# EAGLE design power led v4 (EAGLE 9.6.0)
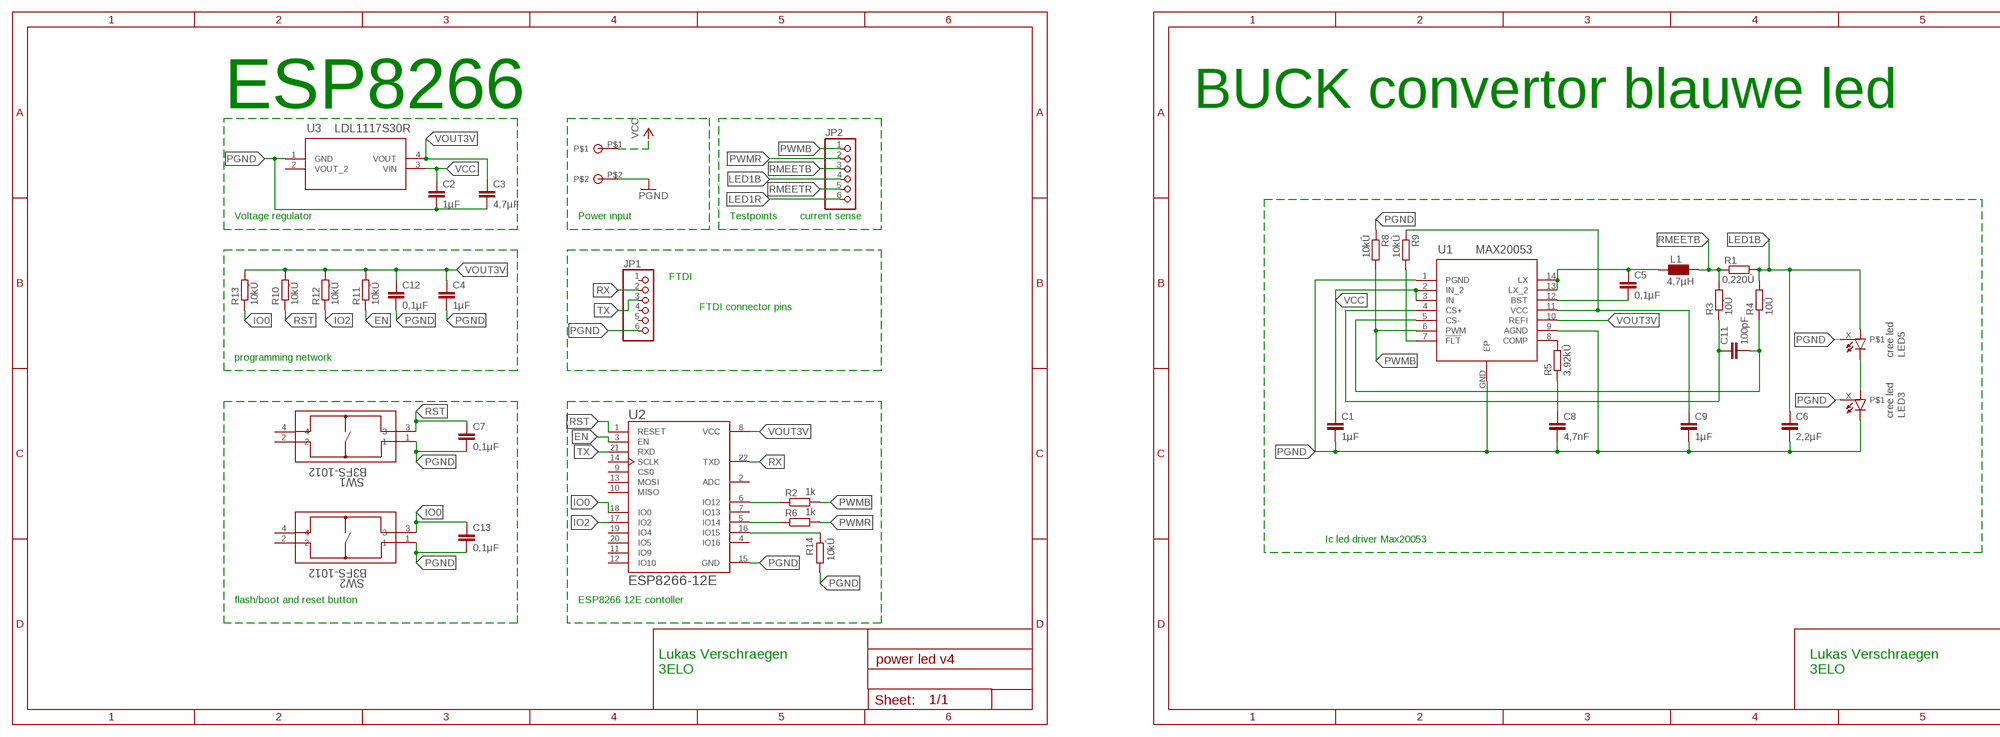
[diagram p0: schematic, sheet 1, part 1 of 2]
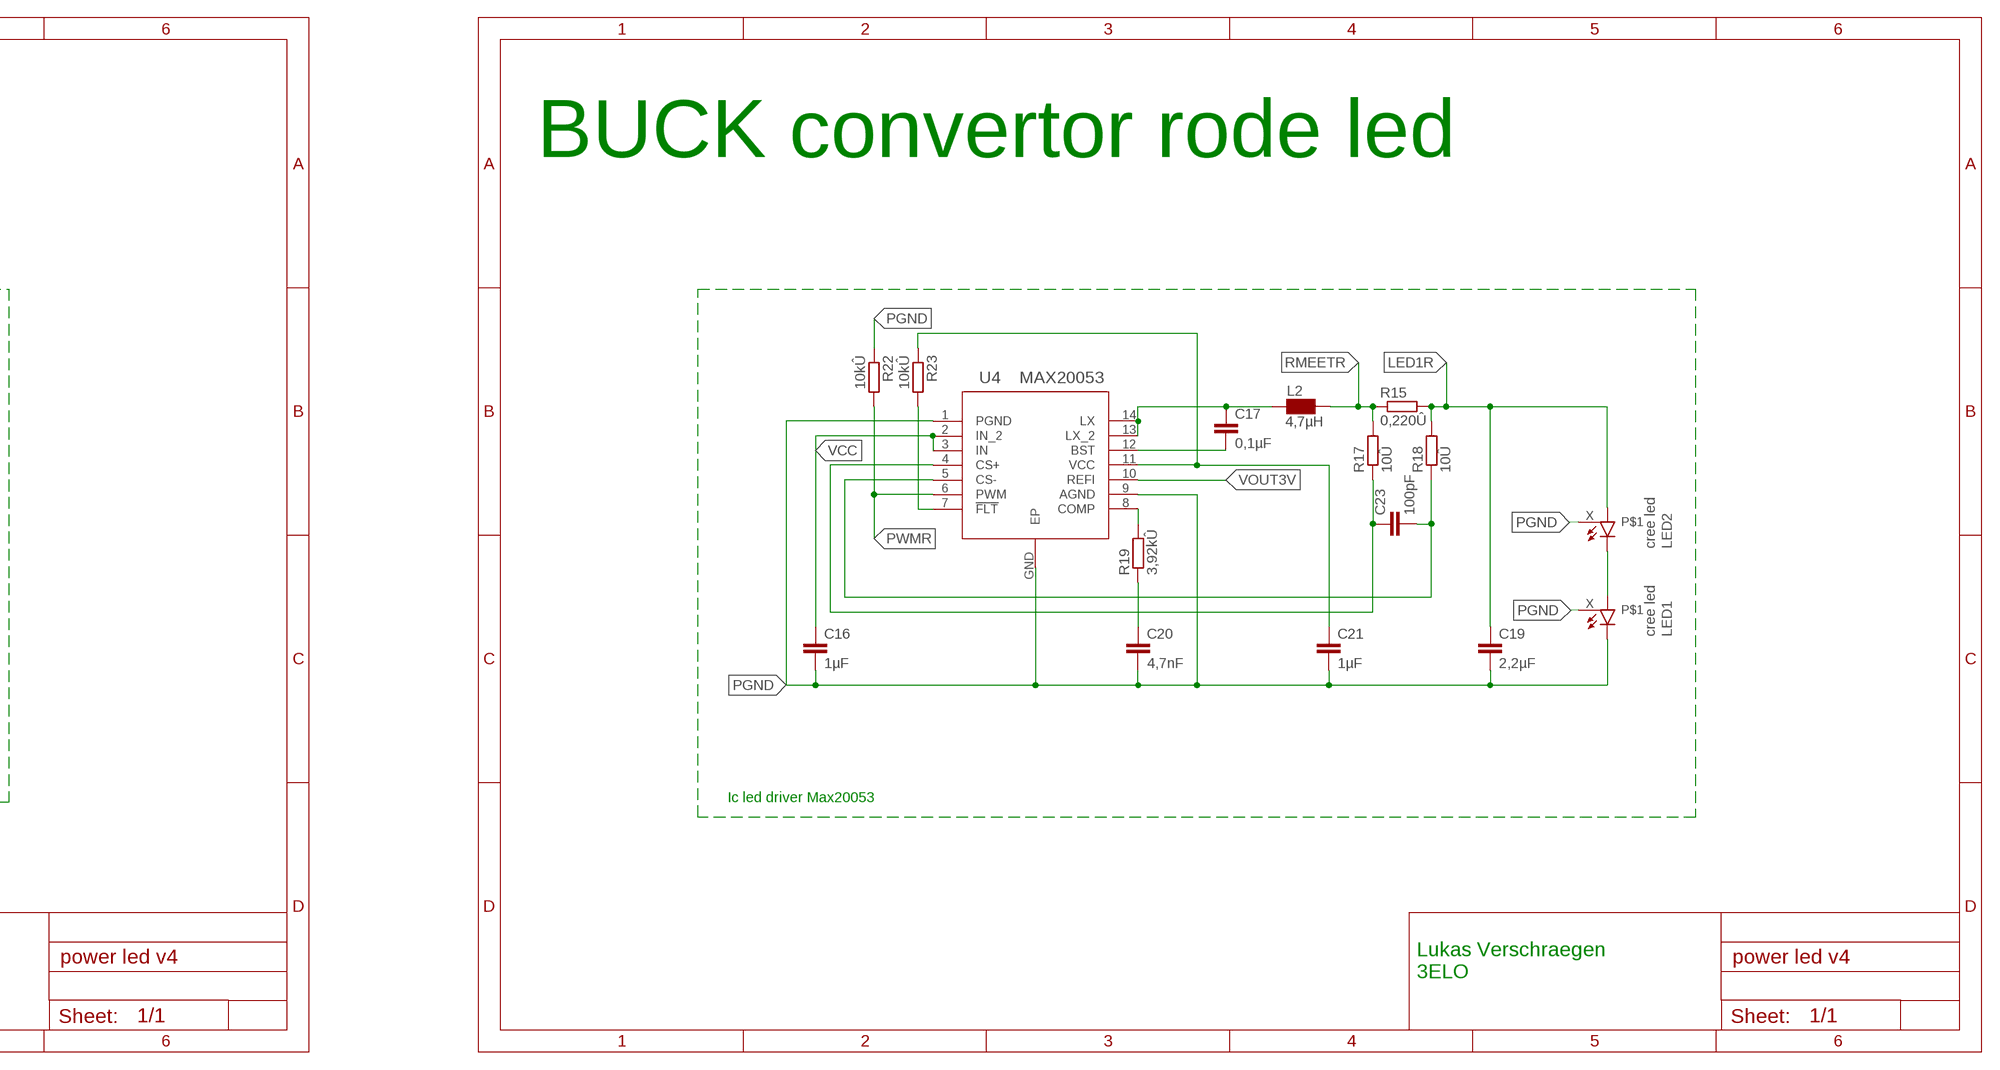
[diagram p1: schematic, sheet 1, part 2 of 2]

## Parts
C1  1µF  C-EUC1206  [C1206]
C2  1µF  C-EUC1206  [C1206]
C3  4,7µF  C-EUC1206  [C1206]
C4  1µF  C-EUC1206  [C1206]
C5  0,1µF  C-EUC1206  [C1206]
C6  2,2µF  C-EUC1206  [C1206]
C7  0,1µF  C-EUC1206  [C1206]
C8  4,7nF  C-EUC1206  [C1206]
C9  1µF  C-EUC1206  [C1206]
C11  100pF  C-EUC1206  [C1206]
C12  0,1µF  C-EUC1206  [C1206]
C13  0,1µF  C-EUC1206  [C1206]
C16  1µF  C-EUC1206  [C1206]
C17  0,1µF  C-EUC1206  [C1206]
C19  2,2µF  C-EUC1206  [C1206]
C20  4,7nF  C-EUC1206  [C1206]
C21  1µF  C-EUC1206  [C1206]
C23  100pF  C-EUC1206  [C1206]
JP1  PINHD-1X6  [1X06]
JP2  PINHD-1X6  [1X06]
L1  4,7µH  7447789004IND_7447789004_WRE-M  [IND_7447789004_WRE-M]
L2  4,7µH  7447789004IND_7447789004_WRE-M  [IND_7447789004_WRE-M]
LED1  cree led  XPEWHT-01-0000-00BC2  [CREE_XLAMP]
LED2  cree led  XPEWHT-01-0000-00BC2  [CREE_XLAMP]
LED3  cree led  XPEWHT-01-0000-00BC2  [CREE_XLAMP]
LED5  cree led  XPEWHT-01-0000-00BC2  [CREE_XLAMP]
R1  0,220Û  R-EU_R1206  [R1206]
R2  1k  R-EU_R1206  [R1206]
R3  10Û  R-EU_R1206  [R1206]
R4  10Û  R-EU_R1206  [R1206]
R5  3,92kÛ  R-EU_R1206  [R1206]
R6  1k  R-EU_R1206  [R1206]
R8  10kÛ  R-EU_R1206  [R1206]
R9  10kÛ  R-EU_R1206  [R1206]
R10  10kÛ  R-EU_R1206  [R1206]
R11  10kÛ  R-EU_R1206  [R1206]
R12  10kÛ  R-EU_R1206  [R1206]
R13  10kÛ  R-EU_R1206  [R1206]
R14  10kÛ  R-EU_R1206  [R1206]
R15  0,220Û  R-EU_R1206  [R1206]
R17  10Û  R-EU_R1206  [R1206]
R18  10Û  R-EU_R1206  [R1206]
R19  3,92kÛ  R-EU_R1206  [R1206]
R22  10kÛ  R-EU_R1206  [R1206]
R23  10kÛ  R-EU_R1206  [R1206]
SW1  B3FS-1012  [SW_B3FS-1010_OMR]
SW2  B3FS-1012  [SW_B3FS-1010_OMR]
U1  MAX20053  MAX20053AUD/V+21-0108-E_14L_MXM-M  [21-0108-E_14L_MXM-M]
U2  ESP8266-12E  ESP8266-12E/ESP-12E  [XCVR_ESP8266-12E/ESP-12E]
U3  LDL1117S30R  [SOT223_STM]
U4  MAX20053  MAX20053AUD/V+21-0108-E_14L_MXM-M  [21-0108-E_14L_MXM-M]
X1  TERMINA5MM  [TERMINAL5MM]

## Nets
BSTB: C5.2 U1.12(BST)
BSTR: C17.2 U4.12(BST)
COMPB: R5.2 U1.8(COMP)
COMPR: R19.2 U4.8(COMP)
CS+B: C11.1 R3.1 U1.4(CS+)
CS+R: C23.1 R17.1 U4.4(CS+)
CS-B: C11.2 R4.1 U1.5(CS-)
CS-R: C23.2 R18.1 U4.5(CS-)
EN: R11.1 U2.3(EN)
FLTB: R9.2 U1.7(!FLT)
FLTR: R23.2 U4.7(!FLT)
IO0: C13.1 R13.1 SW2.3 U2.18(IO0)
IO2: R12.1 U2.17(IO2)
IO15: R14.1 U2.16(IO15)
LED1B: C6.1 JP2.4 LED5.A LED5.A@1(A) R1.2 R4.2
LED1R: C19.1 JP2.6 LED2.A LED2.A@1(A) R15.2 R18.2
LED2B: LED3.A LED3.A@1(A) LED5.C LED5.C@1(C)
LED2R1: LED1.A LED1.A@1(A) LED2.C LED2.C@1(C)
LXB: C5.1 L1.2 U1.13(LX_2) U1.14(LX)
LXR: C17.1 L2.2 U4.13(LX_2) U4.14(LX)
N$2: C20.1 R19.1
N$5: C8.1 R5.1
N$24: R2.1 U2.6(IO12)
N$25: R6.1 U2.5(IO14)
PGND: C1.2 C2.2 C3.2 C4.2 C6.2 C7.2 C8.2 C9.2 C12.2 C13.2 C16.2 C19.2 C20.2 C21.2 JP1.6 LED1.C LED1.C@1(C) LED1.X LED2.X LED3.C LED3.C@1(C) LED3.X LED5.X R8.1 R14.2 R22.1 SW1.1 SW2.1 U1.1(PGND) U1.9(AGND) U1.GND(EP) U2.15(GND) U3.1(GND) U4.1(PGND) U4.9(AGND) U4.GND(EP) X1.P$2
PWMB: JP2.1 R2.2 R8.2 U1.6(PWM)
PWMR: JP2.2 R6.2 R22.2 U4.6(PWM)
RMEETB: JP2.3 L1.1 R1.1 R3.2
RMEETR: JP2.5 L2.1 R15.1 R17.2
RST: C7.1 R10.1 SW1.3 U2.1(RESET)
RX: JP1.2 U2.22(TXD)
TX: JP1.3 U2.21(RXD)
VCC: C1.1 C2.1 C16.1 U1.2(IN_2) U1.3(IN) U3.3(VIN) U4.2(IN_2) U4.3(IN) X1.P$1
VCCB: C9.1 R9.1 U1.11(VCC)
VCCR: C21.1 R23.1 U4.11(VCC)
VOUT3V: C3.1 C4.1 C12.1 R10.2 R11.2 R12.2 R13.2 U1.10(REFI) U2.8(VCC) U3.4(VOUT) U4.10(REFI)
Unconnected: JP1.1 JP1.4 JP1.5 SW1.2 SW1.4 SW2.2 SW2.4 U2.2(ADC) U2.4(IO16) U2.7(IO13) U2.9(CS0) U2.10(MISO) U2.11(IO9) U2.12(IO10) U2.13(MOSI) U2.14(SCLK) U2.19(IO4) U2.20(IO5) U3.2(VOUT_2)

## Notes on the sheet
- ESP8266 | BUCK convertor blauwe led | BUCK convertor rode led
- Voltage regulator | Power input | Testpoints | current sense
- FTDI
- FTDI connector pins
- programming network
- Ic led driver Max20053
- Ic led driver Max20053
- flash/boot and reset button | ESP8266 12E contoller
- Lukas Verschraegen
  3ELO
- Lukas Verschraegen
  3ELO
- Lukas Verschraegen
  3ELO

## Library data of the parts
C1-C9 C11-C13 C16 C17 C19-C21 C23 = rcl:C-EU: CAPACITOR, European symbol; SPICEPREFIX: C
JP1 JP2 = pinhead:PINHD-1X6: PIN HEADER
L1 L2 = 7447789004:7447789004; COPYRIGHT: Copyright (C) 2022 Ultra Librarian. All rights reserved.; MANUFACTURER_PART_NUMBER: 7447789004; MFR_NAME: Wurth Electronics
LED1-LED3 LED5 = led:XPEWHT-: Cree® XLamp® XP-E LEDs Source: www.cree.com/xlamp .. XLampXP-E.pdf
R1-R6 R8-R15 R17-R19 R22 R23 = rcl:R-EU_: RESISTOR, European symbol; SPICEPREFIX: R
SW1 SW2 = omron B3FS-1012:B3FS-1012; BUILT_BY: EMA_Justin; COPYRIGHT: Copyright (C) 2018 Accelerated Designs. All rights reserved; DATASHEET: https://omronfs.omron.com/en_US/ecb/products/pdf/en-b3fs.pdf; MANUFACTURER_PART_NUMBER: B3FS-1012; SOURCELIBRARY: Omron_2020-06-30; VENDOR: Omron
U1 U4 = max20053:MAX20053AUD/V+; COPYRIGHT: Copyright (C) 2022 Ultra Librarian. All rights reserved.; MANUFACTURER_PART_NUMBER: MAX20053AUD/V+; MFR_NAME: Maxim Integrated Products
U2 = ESP8266-12E_ESP-12E:ESP8266-12E/ESP-12E: ESP-12E WiFi Module Check availability <https://pricing.snapeda.com/parts/ESP8266-12E/ESP-12E/AI-Thinker/view-part?ref=eda>; AVAILABILITY: Not in stock; DESCRIPTION: This WiFi module has a 32-bit MCU micro and clock speeds supporting 80 MHz or 160 MHz. Supports the RTOS and integrated Wi-Fi MAC/BB/RF/PA/LNA, and has an on-board antenna.; MF: AI-Thinker; MP: ESP8266-12E/ESP-12E; PACKAGE: None; PRICE: None
U3 = ldl1117s30r:LDL1117S30R; COPYRIGHT: Copyright (C) 2022 Ultra Librarian. All rights reserved.; MANUFACTURER_PART_NUMBER: LDL1117S30R; MFR_NAME: STMicroelectronics
X1 = Terminal 5mm:TERMINA5MM

## Board
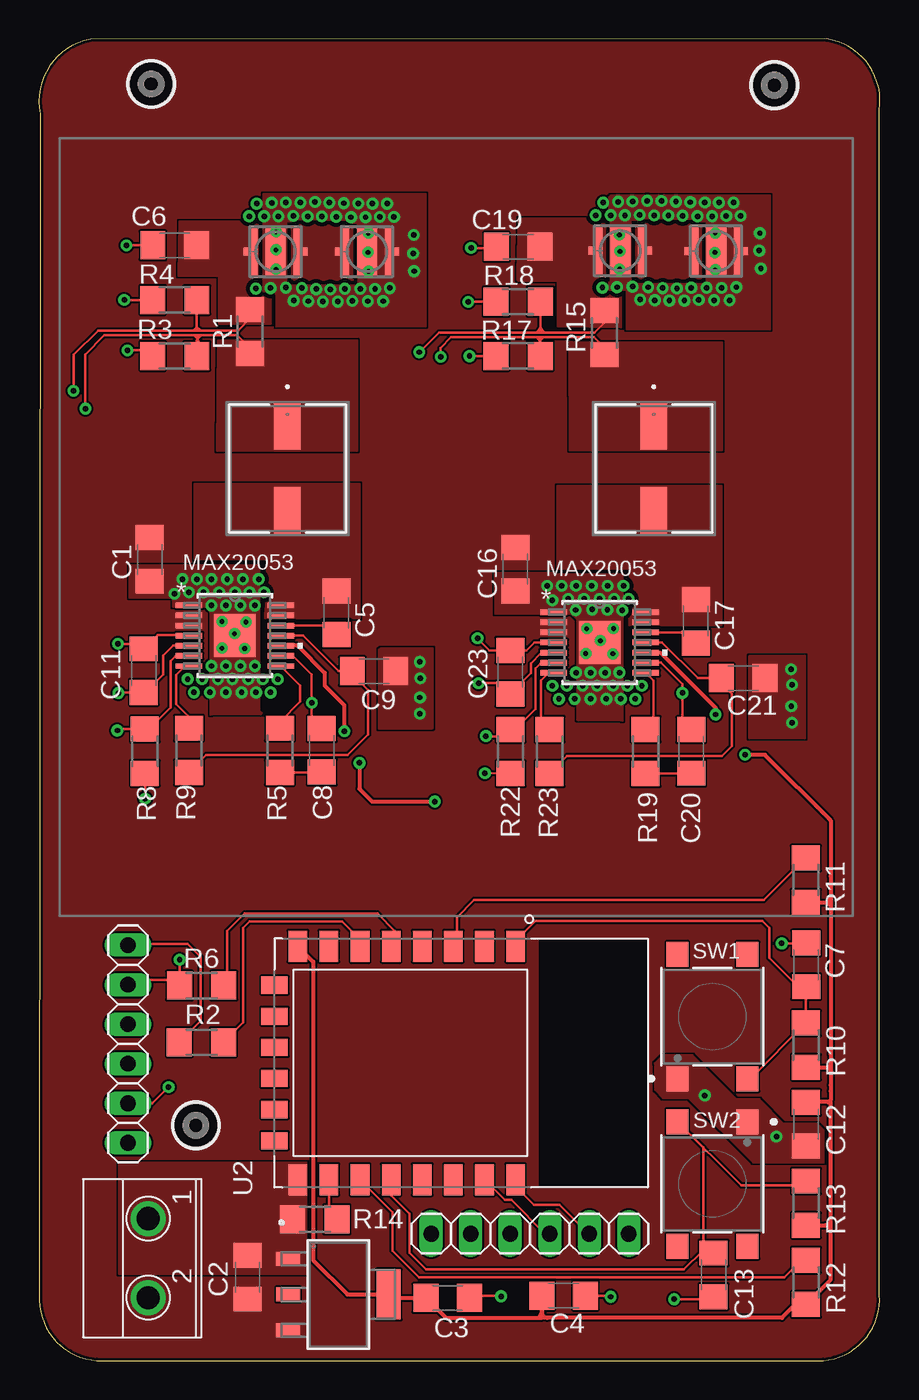
[diagram p2: board, top side]
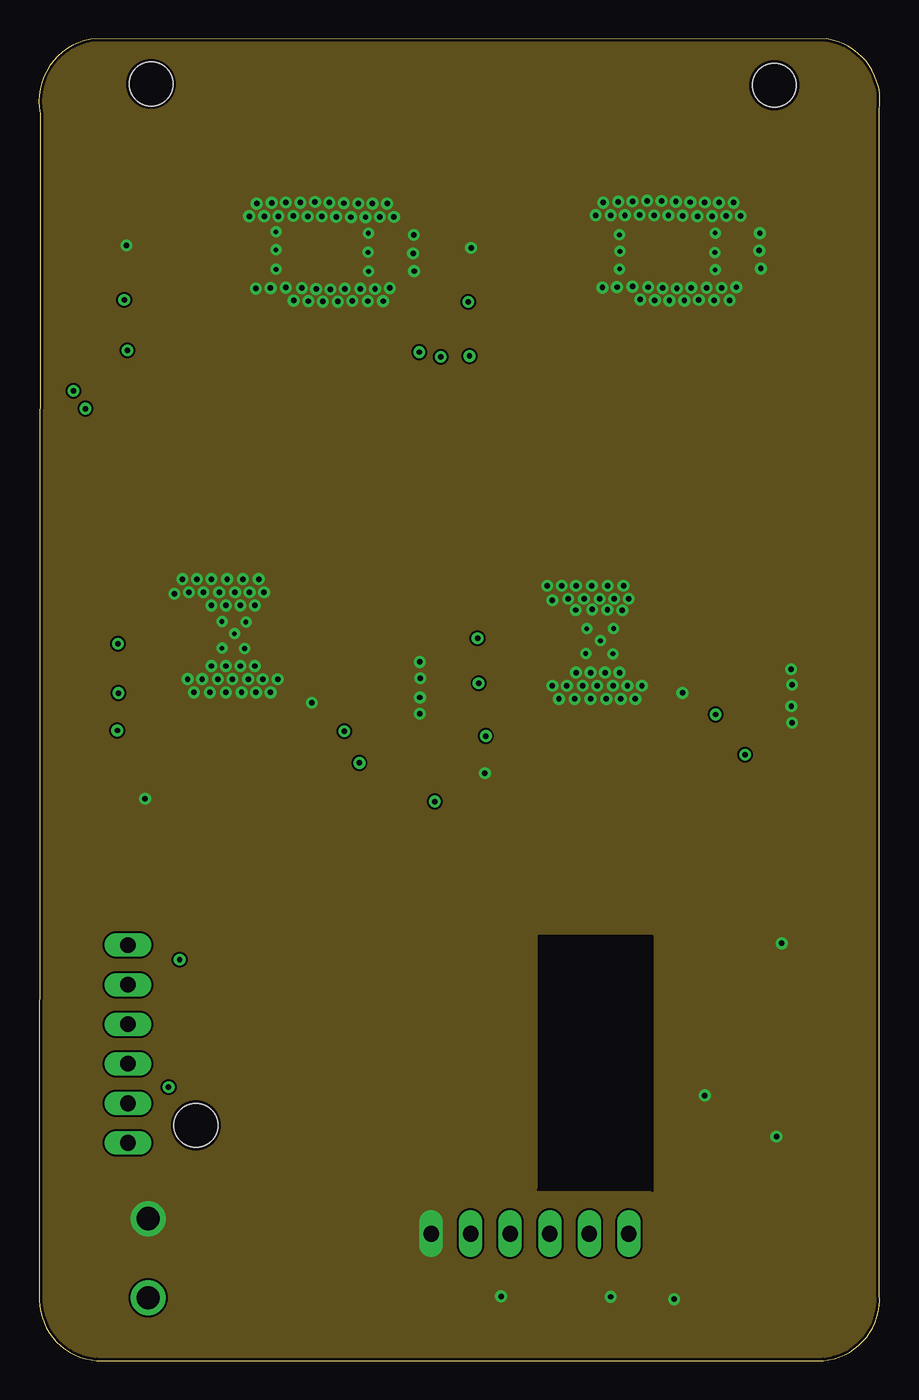
[diagram p3: board, inner layer AGND]
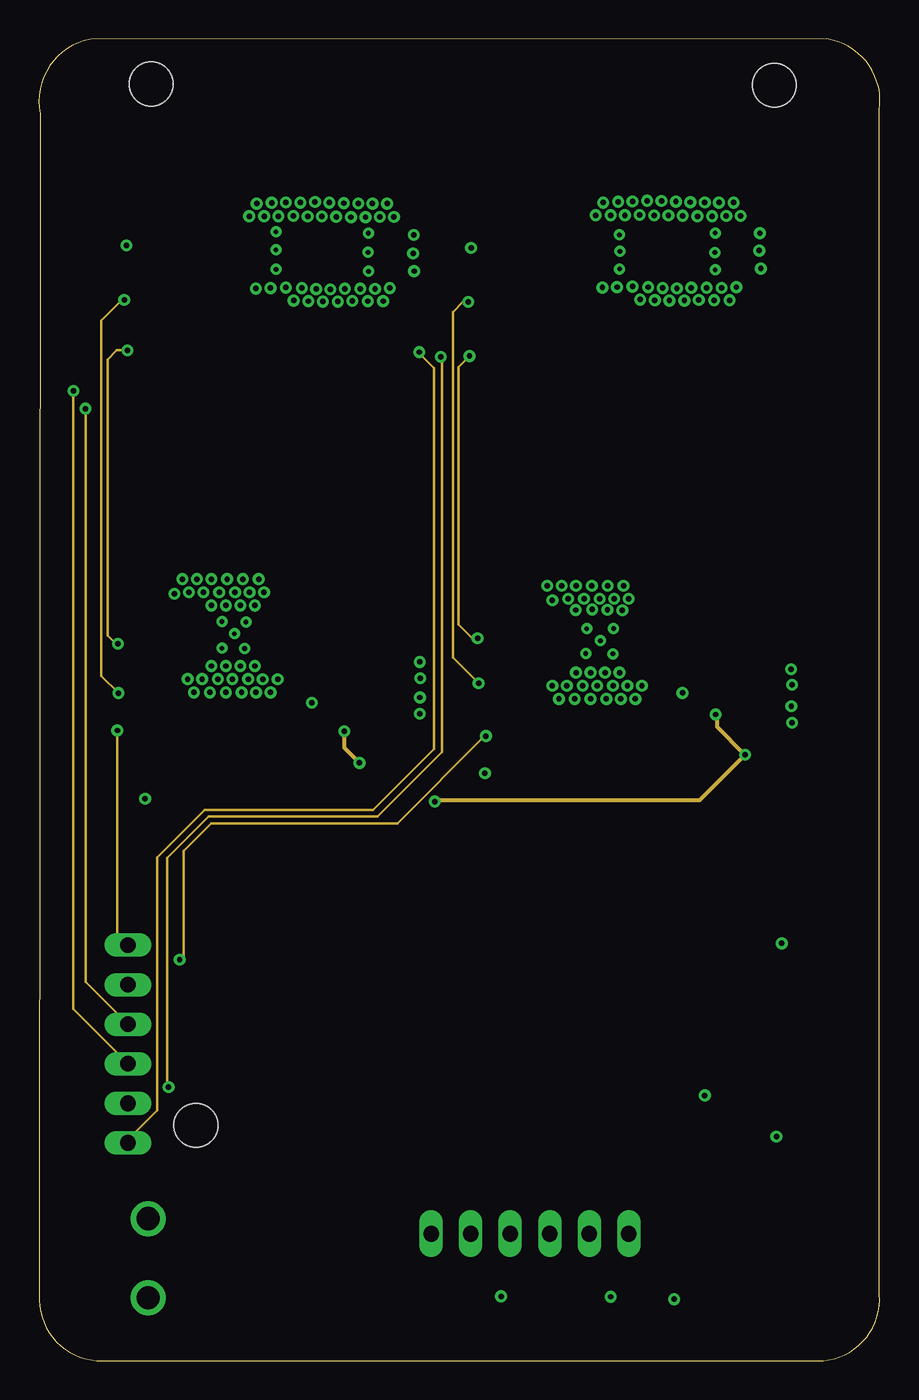
[diagram p4: board, inner layer SIGNAL]
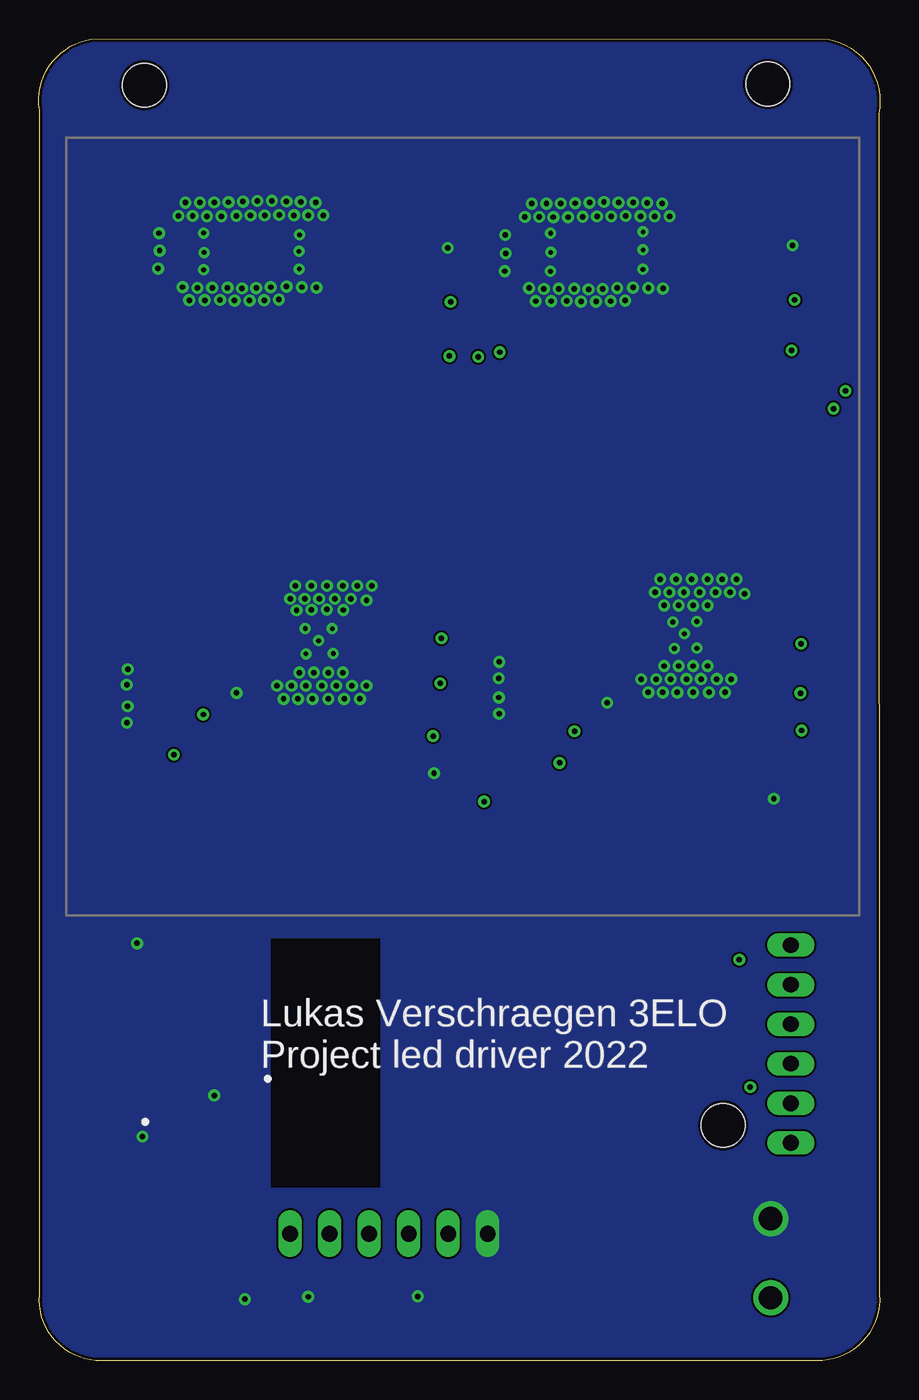
[diagram p5: board, bottom side, seen from below]

Size 54.07 x 84.95 mm. Coordinates in mm from the lower left corner, seen from the top.
Outline: 0.07,80.15 0.03,4.23 arc90 3.72,0 50.41,0 arc90 54.03,4.24 54.03,80.38 arc90 50.65,84.96 3.32,84.94 arc90 0.07,80.15
Copper layers (1+2*15+16): SIGNAL+POWER 0.035mm / dielectric 0.2mm / AGND 0.0175mm / dielectric 1.065mm / SIGNAL 0.0175mm / dielectric 0.2mm / PGND 0.035mm
Design rules "jlcpcb-4layers *": minimum track width 3.5mil, minimum drill 0.2mm, track to track 5mil, track to pad 0.2mm, pad to pad 5mil, via to via 0.5mm, smd to smd 5mil, copper to edge 0.2mm, drill to drill 6mil, minimum pad ring 10mil, minimum via ring 8mil, stop-mask expansion 0.05mm, vias tented up to drill 16mil, thermal gap 10mil

### Footprints (pad centres in the part's own frame; a part is rotated, then mirrored left to right if it is on the bottom)
C1206 = smd 1.6 x 1.8: 1 -1.4,0; 2 1.4,0
1X06 = drill 1.016 long: 1 -6.35,0; 2 -3.81,0; 3 -1.27,0; 4 1.27,0; 5 3.81,0; 6 6.35,0
IND_7447789004_WRE-M = smd 3.048 x 1.702: 1 -2.731,0; 2 2.731,0
CREE_XLAMP = smd 0.5 x 3.3: A -1.4,0; C 1.4,0 | smd 0.45 x 0.5: A@1 -1.825,0; C@1 1.825,0 | smd 1.3 x 3.3: X 0,0
R1206 = smd 1.6 x 1.803: 1 -1.422,0; 2 1.422,0
SW_B3FS-1010_OMR = smd 1.6 x 1.4: 1 -4,2.25; 2 4,2.25; 3 -4,-2.25; 4 4,-2.25
21-0108-E_14L_MXM-M = smd 1.716 x 0.351: 1 -2.951,1.95; 2 -2.951,1.3; 3 -2.951,0.65; 4 -2.951,0; 5 -2.951,-0.65; 6 -2.951,-1.3; 7 -2.951,-1.95; 8 2.951,-1.95; 9 2.951,-1.3; 10 2.951,-0.65; 11 2.951,0; 12 2.951,0.65; 13 2.951,1.3; 14 2.951,1.95 | smd 2.665 x 2.77: GND 0,0
XCVR_ESP8266-12E/ESP-12E = smd 2 x 1.2: 1 -7.5,7; 2 -7.5,5; 3 -7.5,3; 4 -7.5,1; 5 -7.5,-1; 6 -7.5,-3; 7 -7.5,-5; 8 -7.5,-7; 15 7.5,-7; 16 7.5,-5; 17 7.5,-3; 18 7.5,-1; 19 7.5,1; 20 7.5,3; 21 7.5,5; 22 7.5,7 | smd 1.1 x 1.7: 9 -5,-8.5; 10 -3,-8.5; 11 -1,-8.5; 12 1,-8.5; 13 3,-8.5; 14 5,-8.5
SOT223_STM = smd 0.901 x 1.549: 1 -2.3,-3.226; 2 0,-3.226; 3 2.3,-3.226 | smd 3.2 x 1.549: 4 0,3.226
2,8 = hole 2.8: 0,0
TERMINAL5MM = drill 1.5: P$1 4.191,2.54; P$2 4.191,7.62

### Placement (x,y rotation side)
C1  7.13,51.49 270 top
C2  13.42,5.36 90 top
C3  26.28,4.03 0 top
C4  33.74,4.18 0 top
C5  19.13,48.07 270 top
C6  8.73,71.68 180 top
C7  49.33,25.44 90 top
C8  18.18,39.22 90 top
C9  21.55,44.31 0 top
C11  6.75,44.35 270 top
C12  49.32,15.19 270 top
C13  43.37,5.51 270 top
C16  30.63,50.87 270 top
C17  42.22,47.53 270 top
C19  30.82,71.6 180 top
C20  41.94,39.15 90 top
C21  45.28,43.87 0 top
C23  30.31,44.25 270 top
JP1  31.57,8.16 180 top
JP2  5.73,20.35 270 top
L1  15.98,57.34 270 top
L2  39.53,57.34 270 top
LED1  43.54,71.31 0 top
LED2  37.37,71.34 0 top
LED3  21.1,71.27 0 top
LED5  15.22,71.27 0 top
R1  13.58,66.13 90 top
R2  10.45,20.46 180 top
R3  8.73,64.57 0 top
R4  8.73,68.17 0 top
R5  15.5,39.22 90 top
R6  10.46,24.1 180 top
R8  6.81,39.17 90 top
R9  9.65,39.22 90 top
R10  49.32,20.27 270 top
R11  49.3,30.88 270 top
R12  49.32,5.04 270 top
R13  49.32,10.12 270 top
R14  17.74,9.08 180 top
R15  36.35,66.07 90 top
R17  30.82,64.58 0 top
R18  30.82,68.07 0 top
R19  39,39.15 90 top
R22  30.32,39.15 90 top
R23  32.83,39.15 90 top
SW1  43.3,22.11 90 top
SW2  43.3,11.36 270 top
U1  12.6,46.6 0 top
U2  23.64,19.13 270 top
U3  19.25,4.25 270 top
U4  36.05,46.16 0 top
U$1  [2,8]  10.09,15.11 0 top
U$2  [2,8]  47.29,81.98 0 top
U$3  [2,8]  7.21,82.05 0 top
X1  2.83,1.5 0 top

### Tracks (layer width: path | path; a pad name or v marks a point on that pad's centre or on a via)
BSTB
  SIGNAL+POWER 0.152: U1.12 18.55,47.25 C5.2
BSTR
  SIGNAL+POWER 0.152: U4.12 41.54,46.81 C17.2
COMPB
  SIGNAL+POWER 0.152: R5.2 15.5,41.06 16.8,42.36 16.8,43.4 U1.8
COMPR
  SIGNAL+POWER 0.152: R19.2 39.5,41.08 39.5,43.71 U4.8
CS+B  (via drill 0.35)
  SIGNAL+POWER 0.152: U1.4 9.61,46.64 7.64,46.64 C11.1 6.43,46.07 v5.07,46.07 | R3.1 6.94,64.94 v5.69,64.94
  SIGNAL 0.152: v5.69,64.94 5.01,64.94 4.42,64.34 4.42,46.62 4.97,46.07 v5.07,46.07
CS+R  (via drill 0.35)
  SIGNAL+POWER 0.152: U4.4 31.86,46.16 31.35,45.65 C23.1 28.97,45.65 v28.2,46.42 | R17.1 27.69,64.58 v27.68,64.57
  SIGNAL 0.152: v27.68,64.57 26.98,63.87 26.98,47.3 27.86,46.42 v28.2,46.42
CS-B  (via drill 0.35)
  SIGNAL+POWER 0.152: U1.5 8.62,45.95 7.98,45.31 7.98,44.11 6.83,42.95 C11.2 5.16,42.95 v5.12,42.91 | v5.49,68.18 5.5,68.17 R4.1
  SIGNAL 0.152: v5.49,68.18 5.34,68.18 4.01,66.85 4.01,44.01 v5.12,42.91
CS-R  (via drill 0.35)
  SIGNAL+POWER 0.152: R18.1 27.62,68.07 v27.61,68.05 | v28.27,43.54 29.61,43.54 C23.2 31.64,44.18 31.64,44.82 32.32,45.5 33.09,45.5 U4.5
  SIGNAL 0.152: v27.61,68.05 27.28,68.05 26.63,67.41 26.63,45.18 v28.27,43.54
EN
  SIGNAL+POWER 0.152: R11.1 46.6,29.6 27.98,29.6 26.87,28.49 26.87,26.86 U2.3
FLTB
  SIGNAL+POWER 0.152: U1.7 9.4,44.65 8.82,44.07 8.82,42.2 9.65,41.36 R9.2
FLTR
  SIGNAL+POWER 0.152: U4.7 33.08,44.19 32.76,44.19 32.29,43.72 32.29,41.12 R23.2
IO0
  SIGNAL+POWER 0.152: R13.1 49.03,11.26 45.15,11.26 SW2.3 42.7,13.71 42.7,7.57 C13.1 42.89,6.91 42.7,7.09 41.46,5.85 24.89,5.85 23.81,6.93 23.81,9.45 22.64,10.62 U2.18
IO2
  SIGNAL+POWER 0.152: R12.1 49.32,6.76 47.93,5.37 24.89,5.37 24.43,5.37 22.74,7.05 22.74,9.53 U2.17
IO15
  SIGNAL+POWER 0.152: U2.16 18.64,9.62 19.16,9.11 R14.1
LED1B  (via drill 0.35)
  SIGNAL+POWER 0.152: 10.38,66.21 12.8,66.21 13.58,66.99 R1.2 | 10.38,66.21 10.16,66.21 | 10.16,66.21 10.16,66.4 10.16,66.43 | 10.16,66.43 10.16,66.44 9.93,66.21 | R4.2 10.16,66.43 | 9.93,66.21 3.81,66.21 2.25,64.65 2.25,62.36 v2.22,62.33 | 9.93,66.21 10.16,66.21 | 10.16,66.43 10.38,66.21
  SIGNAL 0.152: v2.22,62.33 2.22,22.59 JP2.4
  pour SIGNAL+POWER (isolate 0.254, no thermals): 9.04,73.2 9,69.75 11.59,69.75 11.6,66.65 12.36,66.65 12.38,66.64 14.9,66.66 14.9,68.47 14.05,68.47 14.05,73.2
LED1R  (via drill 0.35)
  SIGNAL+POWER 0.152: R15.2 36.35,66.71 35.71,66.07 32.42,66.07 | 32.42,66.07 32.34,66.07 32.25,66.07 | 32.24,66.4 R18.2 | 32.42,66.07 32.3,66.18 | 32.42,66.07 32.46,66.07 32.24,66.38 | 32.25,66.07 32.02,66.07 | 32.02,66.07 25.72,66.07 24.48,64.82 v24.45,64.82 | 32.24,66.38 32.24,66.08 32.25,66.07 | 32.24,66.38 32.24,66.4 | 32.24,66.4 32.02,66.07
  SIGNAL 0.152: JP2.6 5.73,14.21 7.59,16.07 7.59,32.34 10.65,35.4 21.48,35.4 25.39,39.3 25.39,63.78 24.45,64.72 v24.45,64.82
  pour SIGNAL+POWER (isolate 0.254, no thermals): 30.86,73.42 30.78,69.95 30.78,69.48 30.83,69.43 30.83,69.42 33.38,69.42 33.38,66.5 37.43,66.42 37.43,68.64 36.41,68.64 36.41,73.42
LED2B
  pour SIGNAL+POWER (isolate 0.254, no thermals): 16.28,73.09 16.28,69.47 20.25,69.47 20.25,73.09
LED2R1
  pour SIGNAL+POWER (isolate 0.254, no thermals): 38.43,73.14 38.43,69.56 42.54,69.56 42.54,73.14
LXB
  pour SIGNAL+POWER (isolate 0.254, no thermals): 10.03,56.33 20.61,56.33 20.61,47.72 18,47.71 18,47.72 14.55,47.72 14.69,51.51 10.03,51.51
LXR
  pour SIGNAL+POWER (isolate 0.254, no thermals): 33.35,56.2 33.35,50.92 37.98,50.91 37.98,47.27 43.89,47.27 43.89,56.2
N$1
  cutout AGND: 32.15,27.29 32.15,11.04 32.09,10.97 39.38,10.97 39.44,10.91 39.44,27.25 39.4,27.29 32.16,27.29 32.15,27.28
N$2
  SIGNAL+POWER 0.152: C20.1 41.91,37.73 R19.1
N$5
  SIGNAL+POWER 0.152: C8.1 18.15,37.8 R5.1
N$24
  SIGNAL+POWER 0.152: U2.6 20.86,26.85 19.48,28.23 13.55,28.23 13.14,27.82 13.14,21.73 R2.1
N$25
  SIGNAL+POWER 0.152: U2.5 22.87,26.86 22.87,27.62 21.77,28.73 13.21,28.73 12.11,27.62 12.11,24.33 R6.1
PGND  (via drill 0.3, 0.35)
  SIGNAL+POWER 0.152: C6.2 v5.63,71.68 | 16.66,9.87 16.64,9.88 | C19.2 29.33,71.52 v27.78,71.52 | C3.2 27.82,4.16 29.67,4.16 v29.71,4.13 | v36.76,4.1 36.68,4.18 C4.2 | C7.2 49.32,26.82 v47.76,26.82 | C13.2 43.2,3.95 v40.84,3.95 | C8.2 17.54,41.25 v17.54,42.28 17.54,44.09 16.34,45.3 U1.9 | U4.9 40,44.86 41.37,43.49 v41.37,42.92 41.37,41.12 C20.2 | R8.1 v6.83,36.12 | R22.1 v28.67,37.76
  other vias: 47.42,14.4 24.49,41.58 24.49,44.91 46.31,71.35 48.36,44.44 48.41,41 33.01,48.88 9.22,50.23 10.15,50.23 11.08,50.23 12.1,50.23 13.12,50.23 14.13,50.23 10.58,49.39 11.59,49.39 12.61,49.39 13.54,49.39 14.47,49.39 11.08,48.54 12.02,48.54 12.95,48.54 13.88,48.54 11.08,44.64 12.02,44.64 12.95,44.64 13.88,44.64 9.56,43.8 10.49,43.8 11.51,43.8 12.44,43.8 13.46,43.8 14.39,43.8 9.96,42.95 11,42.95 12.02,42.95 13.03,42.95 13.96,42.95 14.89,42.95 32.67,49.81 33.6,49.81 34.53,49.81 35.55,49.81 36.57,49.81 37.58,49.81 34.03,48.96 35.04,48.96 36.06,48.96 36.99,48.96 37.92,48.96 34.51,48.24 35.57,48.28 36.55,48.26 37.51,48.23 34.53,44.22 35.47,44.22 36.4,44.22 37.33,44.22 33.01,43.38 33.94,43.38 34.96,43.38 35.89,43.38 36.91,43.38 37.84,43.37 38.77,43.37 33.43,42.53 34.45,42.53 35.47,42.53 36.48,42.53 37.41,42.53 38.34,42.53 14,74.37 14.97,74.42 15.88,74.45 16.81,74.43 17.75,74.47 18.68,74.43 19.6,74.4 20.53,74.38 21.45,74.37 22.38,74.37 13.52,73.56 14.49,73.56 15.4,73.56 16.35,73.57 17.28,73.55 18.19,73.55 19.11,73.52 20.06,73.49 21,73.49 21.92,73.51 22.83,73.51 13.95,68.91 14.89,68.94 15.88,68.97 16.9,68.94 18.74,68.86 17.83,68.87 19.67,68.9 20.66,68.9 21.61,68.88 22.56,68.94 16.38,68.14 17.32,68.1 18.26,68.07 19.22,68.07 20.15,68.11 21.14,68.1 22.13,68.1 36.28,74.43 37.24,74.49 38.16,74.51 39.1,74.55 40.03,74.54 40.95,74.5 41.88,74.46 42.81,74.45 43.72,74.43 44.66,74.43 35.8,73.62 36.76,73.62 37.68,73.62 38.63,73.63 39.56,73.61 40.47,73.61 41.38,73.58 42.34,73.56 43.28,73.56 44.19,73.57 45.11,73.57 36.23,68.97 37.17,69 38.16,69.04 39.17,69 40.1,68.94 41.02,68.92 41.94,68.96 42.93,68.96 43.89,68.95 44.84,69 38.65,68.2 39.59,68.16 40.53,68.14 41.5,68.14 42.43,68.17 43.42,68.16 44.41,68.16 46.41,70.19 46.35,72.47 24.1,72.35 24.12,70.03 9.65,49.39 8.71,49.29 24.06,71.17 48.42,43.44 48.37,42.05 24.51,43.85 24.5,42.62 42.81,17.04 11.77,47.51 13.31,47.47 12.57,46.72 11.77,45.8 13.22,45.77 35.22,47.04 36.95,47.05 36.09,46.28 35.16,45.45 36.91,45.43 15.23,72.56 15.23,71.4 15.25,70.14 21.18,72.47 21.17,71.23 21.19,70.02 37.32,72.36 37.36,71.3 37.33,70.17 43.48,72.48 43.45,71.22 43.48,70.12 15.35,43.79
  pour PGND (no thermals): 59.62,88.69 59.62,-5.35 -7.98,-5.35 -7.98,88.69
  pour SIGNAL+POWER (isolate 0.254, no thermals): 45.66,45.26 45.66,40.03 49.23,40.03 49.23,45.29 49.22,45.3 45.7,45.3
  pour SIGNAL+POWER (isolate 0.254, no thermals): 21.88,45.67 21.88,40.64 21.89,40.63 25.26,40.63 25.31,40.68 25.31,45.78 21.99,45.78
  pour SIGNAL+POWER (isolate 0.254, no thermals): 5.18,12.71 17.24,12.71 17.24,5.58 5.18,5.58
  pour SIGNAL+POWER (isolate 0.254, no thermals): 39.63,19.1 39.63,17.4 40.13,16.9 41.75,16.9 45.92,12.74 50.45,12.74 50.52,12.8 50.52,14.74 50.05,15.21 47.87,15.21 46.31,16.78 44.84,16.78 42,19.61 40.12,19.61 39.61,19.1
  pour SIGNAL+POWER (isolate 0.254, rank 2, no thermals): 36.79,74.88 36.69,74.78 36.69,68.85 37.8,68.85 37.8,66.31 46.98,66.31 46.98,74.88
  pour SIGNAL+POWER (isolate 0.254, rank 2, no thermals): 14.46,74.98 14.46,68.75 14.5,68.71 15.22,68.71 15.23,68.72 15.23,66.48 24.86,66.48 24.86,74.98
  pour SIGNAL+POWER (isolate 0.254, rank 2, no thermals): 29.32,50.62 29.34,48.03 31.92,48.03 34.25,48 34.62,47.64 34.62,41.22 34.68,41.16 37.51,41.16 37.52,41.15 37.52,50.62
  pour AGND (no thermals): 57.03,87.35 57.03,-3.2 56.99,-3.24 -4.91,-3.24 -5.17,87.35
  pour SIGNAL+POWER (isolate 0.254, rank 2, no thermals): 5.85,51.12 14.17,51.12 14.17,41.77 14.37,41.57 11.09,41.57 11.06,41.53 11.06,48.21 10.8,48.46 8.62,48.46 8.62,49.05 5.82,49.05 5.85,49.07
PWMB  (via drill 0.35)
  SIGNAL+POWER 0.152: U1.6 9.6,45.24 8.75,45.24 8.48,44.97 8.48,41.99 7.16,40.67 7.08,40.59 R8.2 5.13,40.59 v5.04,40.5 | JP2.1 5.79,26.77 9.58,26.77 10.41,25.93 10.41,21.85 R2.2
  SIGNAL 0.152: v5.04,40.5 5.04,27.4 JP2.1
PWMR  (via drill 0.35)
  SIGNAL+POWER 0.152: U4.6 33.06,44.82 32.25,44.82 31.92,44.49 31.92,41.88 29.9,39.86 R22.2 30.32,40.11 28.77,40.11 v28.73,40.14 | JP2.2 5.88,24.48 8.66,24.48 | R6.2 8.66,24.48 | 8.66,24.48 9.05,24.48 v9.05,25.77
  SIGNAL 0.152: v28.73,40.14 28.66,40.14 23.05,34.54 11.08,34.54 9.29,32.75 9.29,26.01 v9.05,25.77
RMEETB  (via drill 0.35)
  SIGNAL+POWER 0.152: 9.95,65.9 4.2,65.9 2.97,64.67 2.97,61.21 v2.99,61.19 | 9.95,65.9 10.21,65.9 | 10.21,65.9 10.46,65.9 | R1.1 13.58,65.06 12.74,65.9 10.46,65.9 | 10.21,65.9 10.21,65.65 | 10.21,65.65 10.21,65.53 | 10.21,65.65 10.46,65.9 | 10.21,65.65 9.95,65.9
  SIGNAL+POWER 0.257: 10.21,65.53 R3.2
  SIGNAL 0.152: v2.99,61.19 3.02,61.16 3.02,24.34 JP2.3
  pour SIGNAL+POWER (isolate 0.254, no thermals): 12.17,65.55 11.53,65.56 11.47,58.49 20.44,58.49 20.44,65.55
RMEETR  (via drill 0.35)
  SIGNAL+POWER 0.152: R15.1 36.1,64.9 36.1,65.35 35.67,65.79 32.25,65.79 | v25.83,64.52 25.81,64.54 25.81,65.09 26.51,65.79 32.25,65.79 | v8.34,17.59 7.3,16.55 JP2.5 | R17.2 32.25,65.5 | 32.25,65.5 32.25,65.53 32.25,65.79 | 32.24,64.98 32.24,65.55 32.47,65.78 32.05,65.79 | 32.05,65.79 | 32.25,65.5 32.03,65.78 | 32.05,65.78 32.05,65.79
  SIGNAL+POWER 0.257: R17.2 32.24,64.98
  SIGNAL 0.152: v25.83,64.52 25.91,64.44 25.91,39.12 21.76,34.98 10.9,34.98 8.25,32.32 8.25,17.68 v8.34,17.59
  pour SIGNAL+POWER (isolate 0.254, no thermals): 34.28,65.43 43.91,65.43 43.91,58.52 34.14,58.52 34.11,65.46 34.28,65.46
RST
  SIGNAL+POWER 0.152: C7.1 49.26,24.04 | 49.26,24.04 48.79,24.04 46.94,25.88 46.94,27.8 46.5,28.25 31.92,28.25 30.64,26.97 U2.1 | 49.26,24.04 49.32,23.98 R10.1 45.73,18.11 SW1.3
RX
  SIGNAL+POWER 0.152: U2.22 30.64,11.21 31.84,10.01 33.47,10.01 35.33,8.16 JP1.2
TX
  SIGNAL+POWER 0.152: JP1.3 32.53,8.16 30.37,10.32 29.96,10.32 U2.21
VCC
  pour SIGNAL+POWER (rank 3, no thermals): -3.35,85.57 55.22,85.57 55.22,-1.7 -3.35,-1.7
VCCB
  SIGNAL+POWER 0.152: U1.11 17,46.6 19.26,44.34 20.12,44.34 C9.1 20.15,44.14 21.17,43.11 21.17,40.24 19.85,38.91 10.77,38.91 R9.1
VCCR
  SIGNAL+POWER 0.152: U4.11 39.01,46.17 40.05,46.17 42.35,43.87 C21.1 43.88,43.52 44.55,42.85 44.55,39.5 43.91,38.86 33.96,38.86 R23.1
VOUT3V  (via drill 0.35)
  SIGNAL+POWER 0.152: 50.91,29.74 50.91,29.71 | U1.10 | 32.11,2.75 32.34,3.24 | 32.24,2.75 32.34,2.85 32.34,3 32.34,3.08 32.67,2.75 | 32.34,2.79 32.3,2.75 | 50.68,29.45 50.65,29.45 | 50.91,8.7 50.64,8.7 50.58,8.7 | 50.91,17.31
  SIGNAL+POWER 0.254: R12.2 48.63,3.61
  SIGNAL+POWER 0.257: U2.8 17.64,25.64 17.64,6.46 19.84,4.25 U3.4 22.71,4.03 C3.1 26.16,2.75 32.11,2.75 32.3,2.75 | R12.2 50.91,5.21 50.91,8.5 | 50.91,29.74 50.91,31.14 50.91,34.71 46.68,38.94 v45.4,38.94 | 50.91,29.45 50.91,29.71 50.68,29.45 50.91,29.45 | 50.91,29.45 50.91,29.21 | 50.91,29.21 50.91,19.71 50.91,19.08 | 50.91,8.5 50.91,8.7 50.91,8.89 | 50.91,8.89 50.91,16.47 | 50.91,16.47 50.91,16.62 | 50.91,16.62 50.91,16.73 | 50.91,16.73 50.91,17.31 50.91,17.72 50.91,18.61 | 50.91,19.08 50.91,18.8 | 50.91,18.8 50.91,18.61 | 48.63,3.61 47.77,2.75 32.67,2.75 32.24,2.75 | 32.34,2.85 32.34,3.24 | U1.10 16.62,45.95 18.37,44.21 18.37,43.39 19.64,42.11 v19.64,40.45 | U4.10 39.95,45.51 43.51,41.95 v43.51,41.53 | v20.61,38.42 20.61,36.75 21.43,35.94 v25.45,35.94 | C4.1 32.34,3 32.34,2.79 | R11.2 50.65,29.45 50.91,29.21 | 50.73,18.81 50.74,18.81 50.91,18.61 | 50.73,18.81 50.88,18.81 50.89,18.8 50.91,18.8 | 50.73,18.81 49.35,18.81 R10.2 | 50.91,18.61 | 50.91,16.62 49.34,16.62 C12.1 | 50.91,16.73 50.69,16.61 50.91,16.47 | R13.2 50.58,8.7 | 50.64,8.7 50.91,8.89 | 50.64,8.7 50.91,8.5 | 50.91,19.08 50.73,18.81
  SIGNAL 0.152: 25.32,36 25.39,35.94 v25.45,35.94
  SIGNAL 0.257: v43.51,41.53 43.59,41.45 43.59,40.75 v45.4,38.94 42.46,36 25.32,36 | v20.61,38.42 19.64,39.39 v19.64,40.45

### Text on the board
bNames: Lukas Verschraegen 3ELO / Project led driver 2022
tDocu: LED1 | LED2 | LED3 | LED4 | L1 | L2 | PWMB | PWMR | RMEETB | RESET | LED1B | ESP8266 | RMEETR | LED1R | FLASH | GND | PGND | TX | RX | 12V | LDO